# EAGLE schematic PCB_sterownika_pasek_LED (EAGLE 6.6.0)
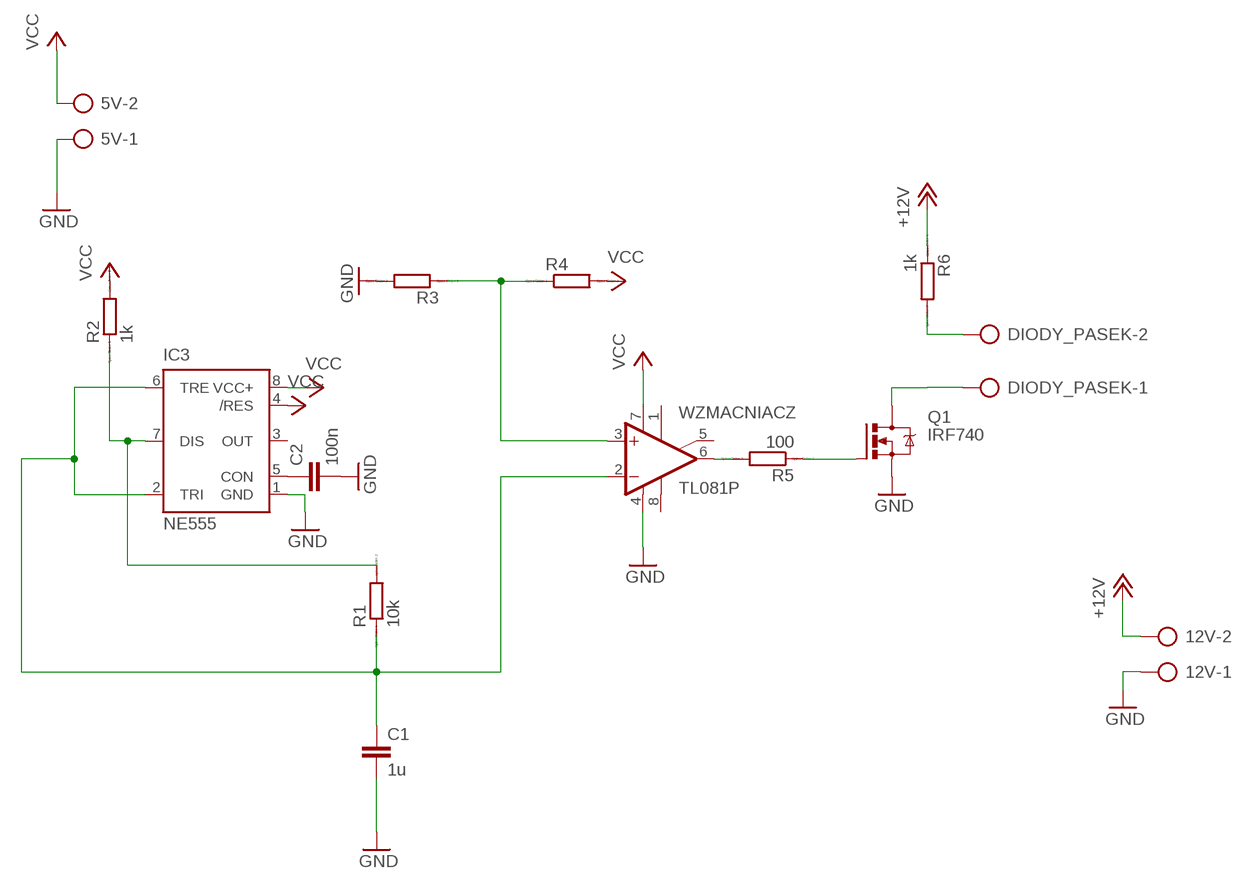
[diagram p0: schematic, sheet 1]

## Parts
5V  AK500/2  [AK500/2]
12V  AK500/2  [AK500/2]
C1  1u  C-EU025-024X044  [C025-024X044]
C2  100n  C-EU025-024X044  [C025-024X044]
DIODY_PASEK  AK500/2  [AK500/2]
IC3  NE555  [DIL-08]
Q1  IRF740  [TO220BV]
R1  10k  R0204/7  [0204/7]
R2  1k  R0204/7  [0204/7]
R3  R0204/7  [0204/7]
R4  R0204/7  [0204/7]
R5  100  R0204/7  [0204/7]
R6  1k  R0204/7  [0204/7]
WZMACNIACZ  TL081P  [DIL08]

## Nets
+12V: 12V.2 R6.1
GND: 5V.1 12V.1 C1.2 C2.2 IC3.1(GND) Q1.S R3.2 WZMACNIACZ.4(V-)
N$1: R3.1 R4.1 WZMACNIACZ.3(+IN)
N$2: IC3.7(DIS) R1.2 R2.1
N$4: C2.1 IC3.5(CON)
N$5: C1.1 IC3.2(TRI) IC3.6(TRE) R1.1 WZMACNIACZ.2(-IN)
N$6: R5.2 WZMACNIACZ.6(OUT)
N$7: Q1.G R5.1
N$8: DIODY_PASEK.2 R6.2
N$9: DIODY_PASEK.1 Q1.D
VCC: 5V.2 IC3.4(/RES) IC3.8(VCC+) R2.2 R4.2 WZMACNIACZ.7(V+)
Unconnected: IC3.3(OUT) WZMACNIACZ.1(ON1) WZMACNIACZ.5(ON2) WZMACNIACZ.8(OPT)

## Library data of the parts
5V 12V DIODY_PASEK = con-ptr500:AK500/2: CONNECTOR; OC_FARNELL: unknown; OC_NEWARK: unknown
C1 C2 = rcl:C-EU: CAPACITOR, European symbol
IC3 = st-microelectronics:NE555: General purpose bipolar Timer; MF: Arrow Electronics; MPN: NE555N; OC_FARNELL: 1467742; OC_NEWARK: 89K1486
Q1 = transistor-power:IRF740: N-CHANNEL MOS FET
R1-R6 = eagle-ltspice:R: RESISTOR, European symbol; SPICEMODEL: NONE; SPICEPREFIX: R
WZMACNIACZ = linear:TL081: OP AMP